# Altium schematic sheet TestPoints.SchDoc: Controlador PID
size A4; Organization: Altium Limited; Address1: L3, 12a Rodborough Rd; Address2: Frenchs Forest; Address3: NSW; Address4: Australia 2086; Revision: R00; sheetnumberh: 5; sheettotall: 5; Alumno: Irumberry Juan - Matwiejczuk Leandro; Curso: 512; Materia: Técnicas Digitales III; Docentes: Ing. Marín Ariel; SheetNumber: 5; SheetTotal: 5
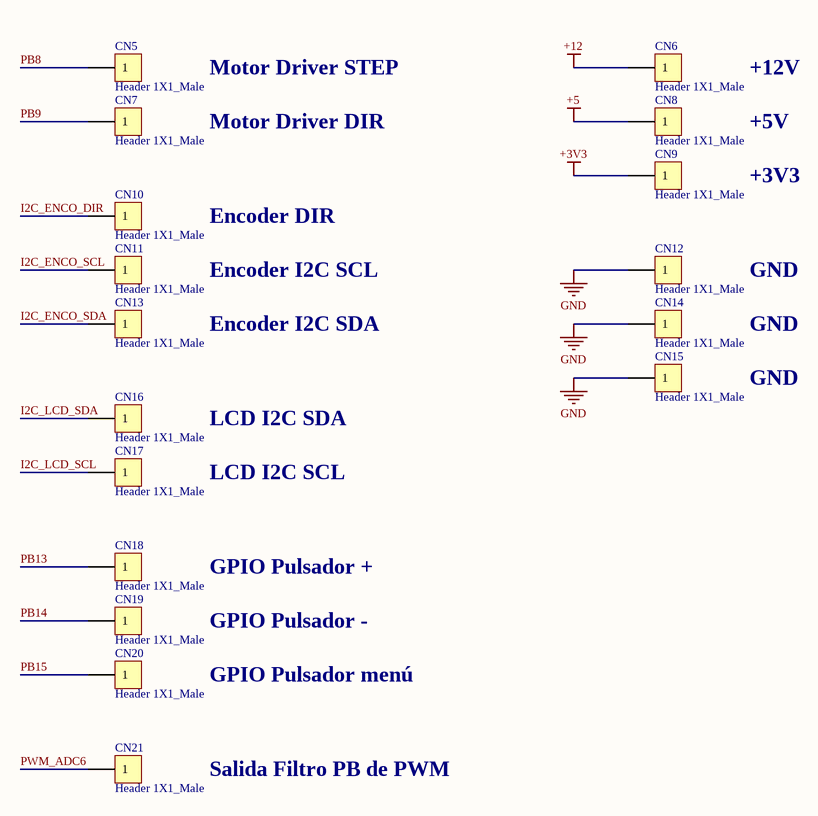
[diagram p0: TestPoints.SchDoc]

## Parts
CN5  Header 1X1_Male  [1*1P_MALE]
CN6  Header 1X1_Male  [1*1P_MALE]
CN7  Header 1X1_Male  [1*1P_MALE]
CN8  Header 1X1_Male  [1*1P_MALE]
CN9  Header 1X1_Male  [1*1P_MALE]
CN10  Header 1X1_Male  [1*1P_MALE]
CN11  Header 1X1_Male  [1*1P_MALE]
CN12  Header 1X1_Male  [1*1P_MALE]
CN13  Header 1X1_Male  [1*1P_MALE]
CN14  Header 1X1_Male  [1*1P_MALE]
CN15  Header 1X1_Male  [1*1P_MALE]
CN16  Header 1X1_Male  [1*1P_MALE]
CN17  Header 1X1_Male  [1*1P_MALE]
CN18  Header 1X1_Male  [1*1P_MALE]
CN19  Header 1X1_Male  [1*1P_MALE]
CN20  Header 1X1_Male  [1*1P_MALE]
CN21  Header 1X1_Male  [1*1P_MALE]

## Nets
+3V3: CN9.1
+5: CN8.1
+12: CN6.1
GND: CN12.1 CN14.1 CN15.1
I2C_ENCO_DIR: CN10.1
I2C_ENCO_SCL: CN11.1
I2C_ENCO_SDA: CN13.1
I2C_LCD_SCL: CN17.1
I2C_LCD_SDA: CN16.1
PB8: CN5.1
PB9: CN7.1
PB13: CN18.1
PB14: CN19.1
PB15: CN20.1
PWM_ADC6: CN21.1

## Notes on the sheet
- Motor Driver STEP
- +12V
- Motor Driver DIR
- +5V
- Encoder DIR
- +3V3
- Encoder I2C SCL
- GND
- Encoder I2C SDA
- LCD I2C SDA
- LCD I2C SCL
- GPIO Pulsador +
- GPIO Pulsador -
- GPIO Pulsador menú
- Salida Filtro PB de PWM
- Title:
- Revision:
- Alumnos:
- Materia:
- Docente:
- Curso:
- File:
- Date:
- Sheet
- of

## Library data of the parts
CN5-CN21 = Header 1X1_Male: Header, 1-Pin, Single row,male; LatestRevisionDate: 17-Jul-2002; LatestRevisionNote: Re-released for DXP Platform.; Publisher: Altium Limited